# EasyEDA Pro project Teensy PCB.epro

# Schematic Schematic1
Board Name: Board1; Create Date: 2026-01-16; Page Name: P1; Project Name: PCB-5; Schematic Name: Schematic1; Update Date: 2026-02-27; Company: EasyEDA.com; Page Size: A4; Version: V1.0
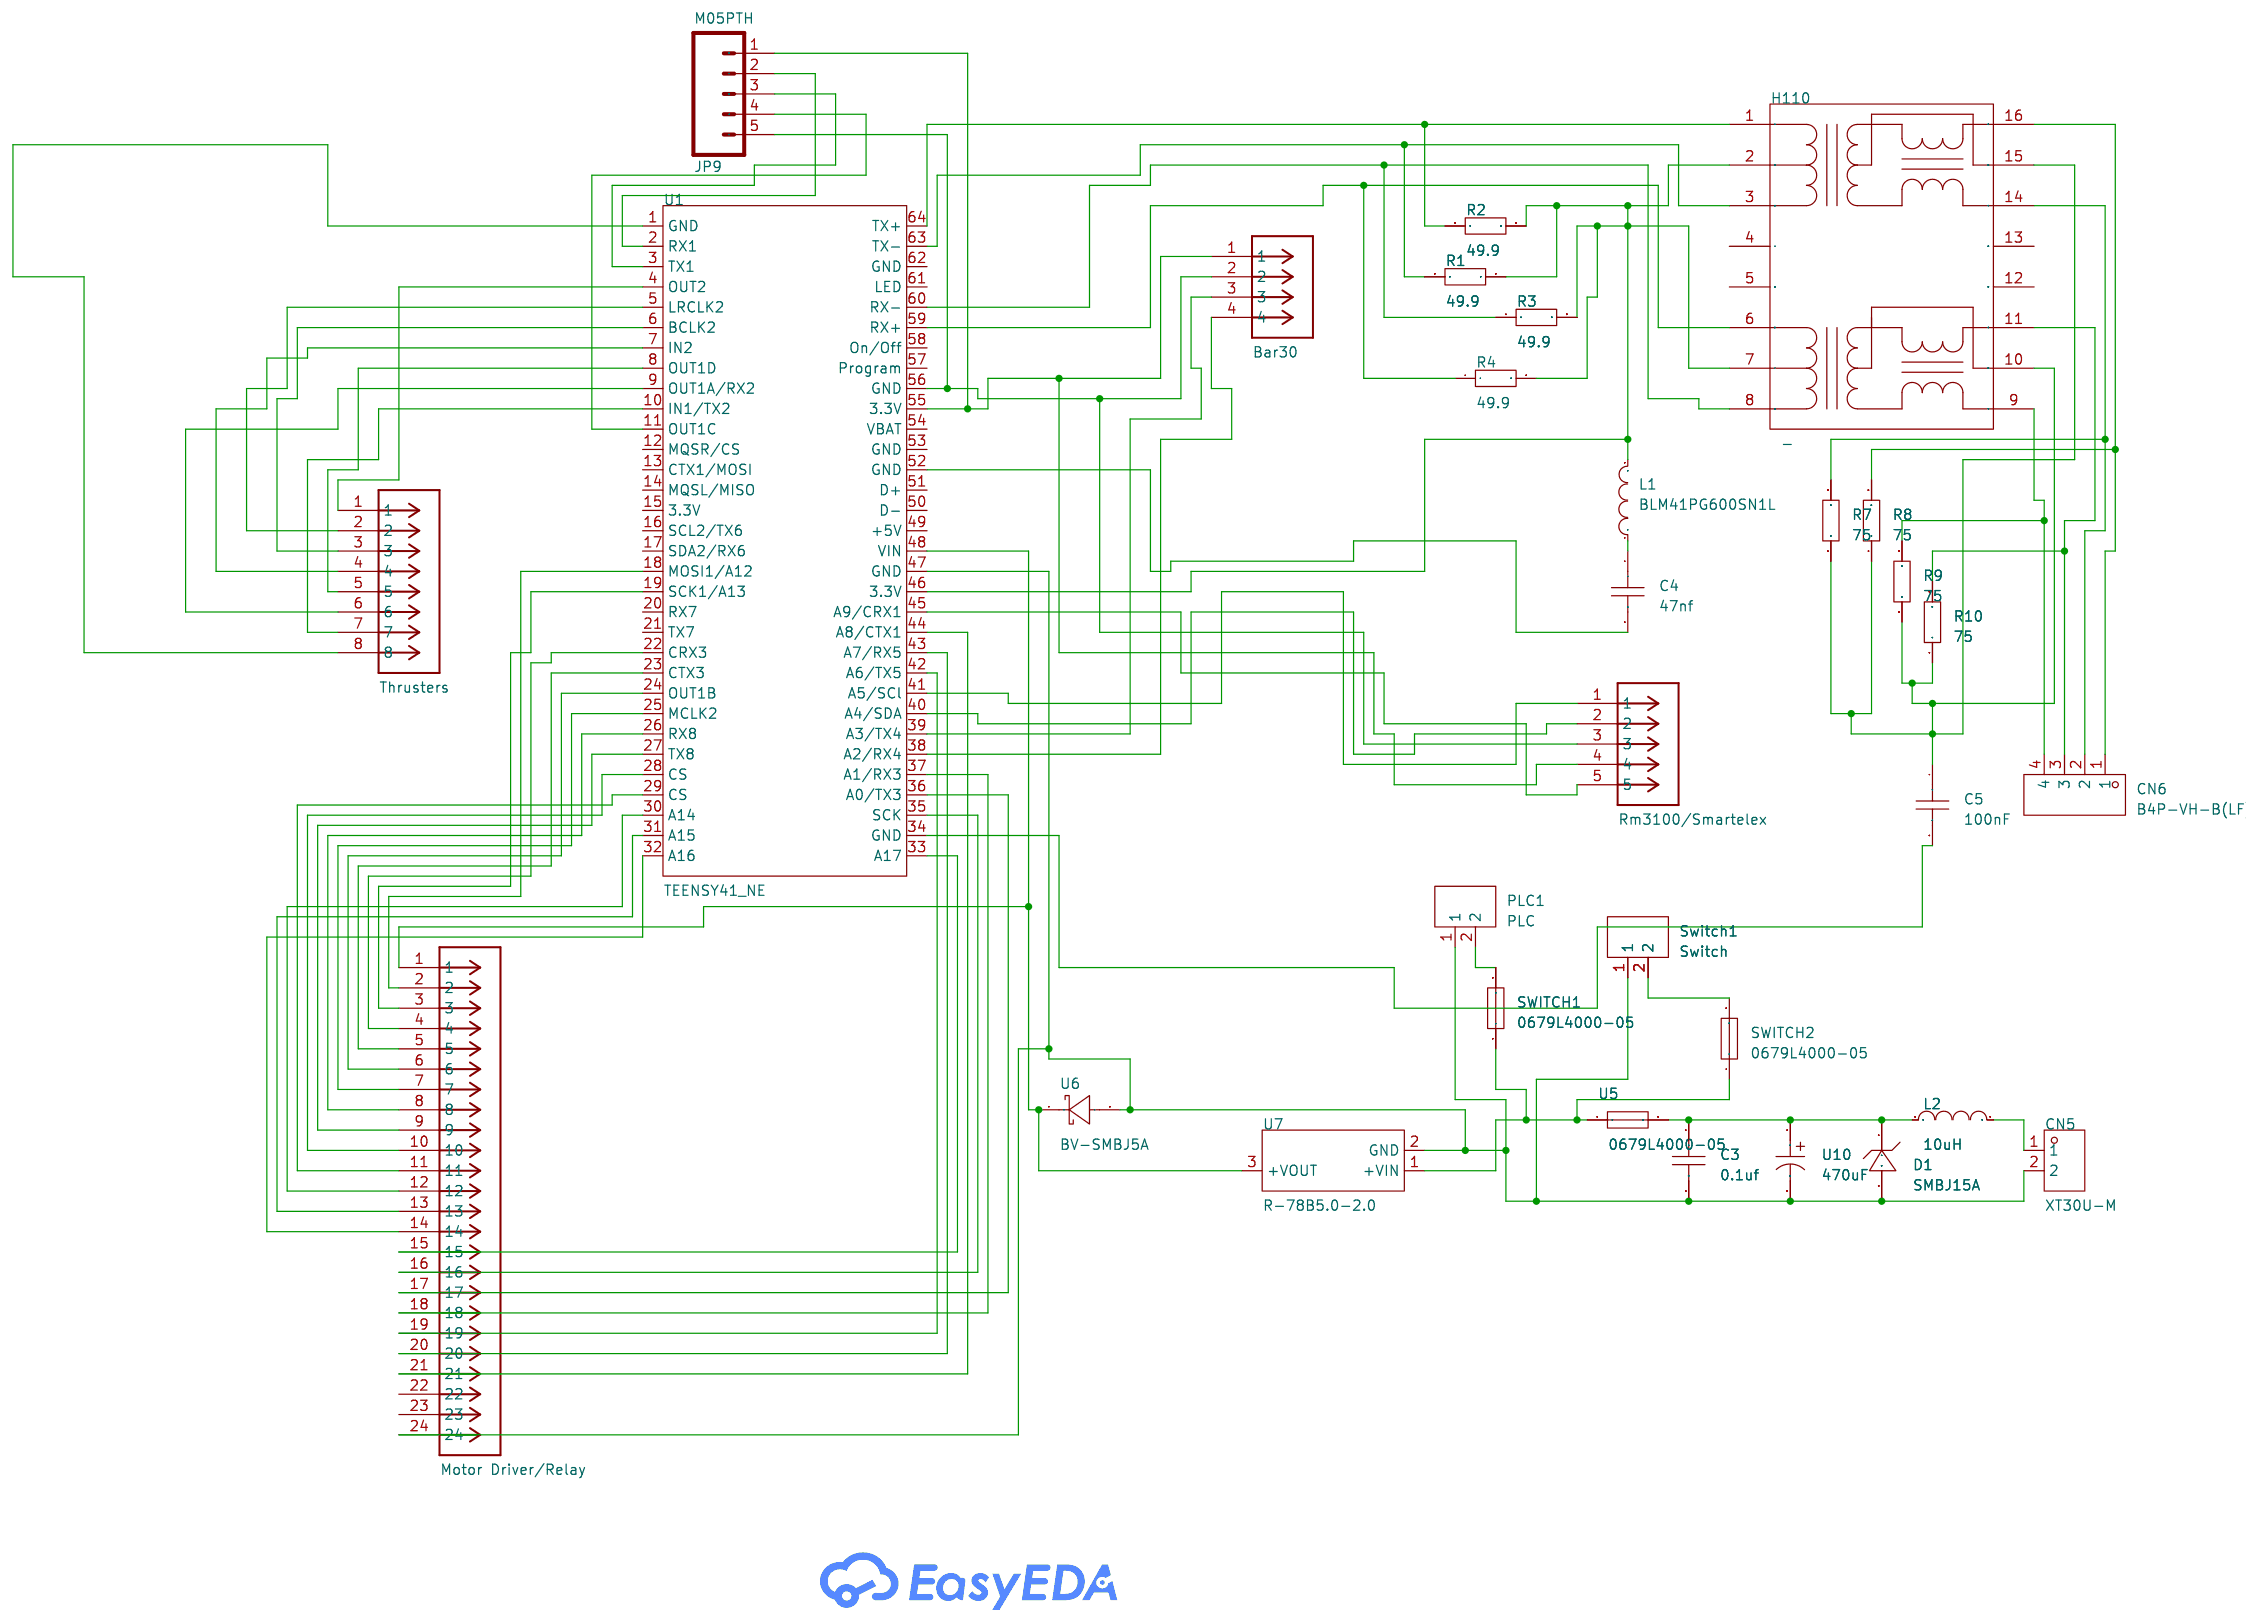
[diagram p0: schematic sheet]

## Parts
Bar30  Bar30  [B4P-VH]
C3  0.1uf  [C0603]
C4  47nf  [C0603]
C5  100nF  [C0603]
CN5  XT30U-M  [CONN-TH_XT30U-M]
CN6  B4P-VH-B(LF)(SN)  [CONN-TH_4P-P3.96_B4P-VH-B-LF-SN]
D1  SMBJ15A  [SMB_L4.6-W3.6-LS5.3-RD]
H110  -  [XFMR-SMD_H1102NLT]
JP9  M05PTH  [1X05]
L1  BLM41PG600SN1L  [L1806]
L2  10uH  [L0603]
MotorDriver/Relay1  Motor Driver/Relay  [15247240]
PLC1  PLC  [CONN-TH_2P-P3.96_DEALON_VH-2A]
R1  49.9  [R0603]
R2  49.9  [R0603]
R3  49.9  [R0603]
R4  49.9  [R0603]
R7  75  [R0603]
R8  75  [R0603]
R9  75  [R0603]
R10  75  [R0603]
SWITCH1  0679L4000-05  [FUSE-SMD_L6.1-W2.5]
Switch1  Switch  [CONN-TH_2P-P3.96_DEALON_VH-2A]
SWITCH2  0679L4000-05  [FUSE-SMD_L6.1-W2.5]
Thrusters1  Thrusters  [444320801]
U1  TEENSY41_NE  [COMM-TH_L60.1-W17.8-P2.54]
U5  0679L4000-05  [FUSE-SMD_L6.1-W2.5]
U6  BV-SMBJ5A  [SMB_L4.6-W3.7-LS5.4-RD]
U7  R-78B5.0-2.0  [PWRM-TH_RECOM_R-78B5.0-2.0]
U10  470uF  [CAP-TH_BD10.0-P5.00-D0.6-FD]
U15  Rm3100/Smartelex  [B5P-VH]

## Library data of the parts
Bar30 = conn_04p_1
C3-C5 = CAP_0603: Supplier Footprint: 0603
CN5 = XT30U-M: LCSC Part Name: AMASS(艾迈斯)轻量版锂电池插头公头 XT30U-M; Supplier Part: C99101; Manufacturer: AMASS(艾迈斯); JLCPCB Part Class: Extended Part; Datasheet: https://item.szlcsc.com/datasheet/XT30U-M/100314.html; Supplier: LCSC
CN6 = B4P-VH-B(LF)(SN): Pins Structure:1x4P Pitch:3.96mm Mounting Style:Direct Insert Reference Series:VH Number of Pins:4P Number of Rows:1 Number of PINs Per Row:4 Row Spacing:- Current Rating (Max):10A Contact Material:Brass Contact Plating:Tin Operating Temperature Range:-25; LCSC Part Name: 1x4P 间距:3.96mm 直插 系列:VH; Supplier Part: C493148; Manufacturer: JST; Supplier Footprint: 插件,P=3.96mm; JLCPCB Part Class: Extended Part; Datasheet: https://atta.szlcsc.com/upload/public/pdf/source/20220208/ECAA58BC68B23E29E576C700CFB0AF43.pdf; Supplier: LCSC; Pins Structure: 1x4P; Pitch: 3.96mm; Mounting Style: Direct Insert; Reference Series: VH; Number of Pins: 4P; Number of Rows: 1; Number of PINs Per Row: 4; Current Rating (Max): 10A; Contact Material: Brass; Contact Plating: Tin; Operating Temperature Range: -25℃~+85℃; Rated Voltage (Max): 250V; Plastic Material: Glass Fiber Reinforced PBT; Flame Retardant Rating: UL94V-0; Colour: White; Z-Height of the Board: 9.4mm; X-Length of Bottom Edge on Board (Spacing Line): 15.78mm; Y-Width of Bottom Edge on Board: 8.5mm
D1 = SMBJ15A_C83846: Polarity:Unidirectional Reverse Stand-Off Voltage (Vrwm):15V Clamping Voltage:24.4V Peak Pulse Current (Ipp):24.6A Peak Pulse Power Dissipation (Ppp):600W Voltage - Breakdown:16.7V Reverse Leakage Current (Ir):1uA Operating Temperature:-65℃~+150℃ Operatin; LCSC Part Name: 单向TVS 15V截止 峰值浪涌电流：24.6A; Supplier Part: C83846; Manufacturer: Littelfuse(美国力特); Supplier Footprint: DO-214AA; JLCPCB Part Class: Extended Part; Datasheet: https://item.szlcsc.com/datasheet/SMBJ15A/85013.html; Supplier: LCSC; Polarity: Unidirectional; Reverse Stand-Off Voltage (Vrwm): 15V; Clamping Voltage: 24.4V; Peak Pulse Current (Ipp): 24.6A; Peak Pulse Power Dissipation (Ppp): 600W; Voltage - Breakdown: 16.7V; Reverse Leakage Current (Ir): 1uA; Operating Temperature: -65℃~+150℃; level of protection: IEC 61000-4-4；IEC 61000-4-2; Type: TVS
H110 = H1102NLT: Turns Ratio:； Number of Channels:- rate:- Function:- Inductance:- Isolation Voltage(Vrms):- operating temperature:0℃~+70℃ operating temperature:0℃~+70℃; Supplier Part: C18584; Manufacturer: PULSE(普思); Supplier Footprint: SMD,12.7x7.1mm; JLCPCB Part Class: Extended Part; Datasheet: https://item.szlcsc.com/datasheet/H1102NLT/19286.html; Supplier: LCSC; Turns Ratio: ；; operating temperature: 0℃~+70℃
JP9 = SparkFun_M05_PTH
L1 = BLM41PG600SN1L: Impedance @ Frequency:60Ω@100MHz Tolerance:±25% Tolerance:±25% DC Resistance(DCR):9mΩ Current Rating:6A Number of Circuits:1; LCSC Part Name: 单路 1806磁珠 阻抗60Ω@100MHz; Supplier Part: C85844; Manufacturer: muRata(村田); Supplier Footprint: 1806; JLCPCB Part Class: Extended Part; Datasheet: https://item.szlcsc.com/datasheet/BLM41PG600SN1L/87020.html; Supplier: LCSC; Impedance @ Frequency: 60Ω@100MHz; Tolerance: ±25%; DC Resistance(DCR): 9mΩ; Current Rating: 6A; Number of Circuits: 1
L2 = L_0603
MotorDriver/Relay1 = conn_024p_000c_1
PLC1 Switch1 = VH-2A: Pins Structure:1x2P Pitch:3.96mm Mounting Type:Through Hole Reference Series:VH Number of Pins:2P Number of Rows:1 Number of PINs Per Row:2 Row Spacing:- Current Rating:7A Contact Material:- Contact Plating:- Operating Temperature:-25℃~+85℃ Operating Temp; LCSC Part Name: 1x2P 间距:3.96mm 直插 系列:VH; Supplier Part: C2905029; Manufacturer: DEALON(德艺隆); Supplier Footprint: 插件,P=3.96mm; JLCPCB Part Class: Extended Part; Datasheet: https://item.szlcsc.com/datasheet/VH-2A/3172314.html; Supplier: LCSC; Pins Structure: 1x2P; Pitch: 3.96mm; Mounting Type: Through Hole; Reference Series: VH; Number of Pins: 2P; Number of Rows: 1; Number of PINs Per Row: 2; Current Rating: 7A; Operating Temperature: -25℃~+85℃; Voltage Rating: 250V; Color: White; Z-Height of the Board: 14.1mm; X-Length of Bottom Edge on Board (Spacing Line): 7.92mm; Y-Width of Bottom Edge on Board: 8.5mm
R1-R4 R7-R10 = Res_0603: Supplier Footprint: 0603
SWITCH1 SWITCH2 U5 = 0679L4000-05: Type:- Current Rating:4A Voltage Rating (AC):125V Voltage Rating (DC):125V Operating Temperature:-55℃~+125℃ Operating Temperature:-55℃~+125℃ Interrupt Rating:50A；300A; LCSC Part Name: 125V; Supplier Part: C3161312; Manufacturer: belfuse; Supplier Footprint: SMD,6.1x2.5mm; JLCPCB Part Class: Extended Part; Datasheet: https://atta.szlcsc.com/upload/public/pdf/source/231023/ds-cp-0679l-series.pdf-3e2d1b65585d6b8342ebf31851bf0027.pdf; Supplier: LCSC; Current Rating: 4A; Voltage Rating (AC): 125V; Voltage Rating (DC): 125V; Operating Temperature: -55℃~+125℃; Interrupt Rating: 50A；300A
Thrusters1 = conn_008p_000c_1
U1 = TEENSY41_NE: Supplier Part: C9900198559; Supplier Footprint: TH-59P; JLCPCB Part Class: Extended Part; Supplier: LCSC
U6 = BV-SMBJ5A: Polarity:Unidirectional Reverse Stand-Off Voltage (Vrwm):5V Clamping Voltage:9.2V Peak Pulse Current (Ipp):65.3A@10/1000us Peak Pulse Power Dissipation (Ppp):600W@10/1000us Voltage - Breakdown:7V Reverse Leakage Current (Ir):800uA Operating Temperature:-5; LCSC Part Name: 单向TVS 5V截止 峰值浪涌电流：65.3A@10/1000us; Supplier Part: C5376239; Manufacturer: Bencent(槟城); Supplier Footprint: SMB; JLCPCB Part Class: Extended Part; Datasheet: https://item.szlcsc.com/datasheet/BV-SMBJ5A/6237095.html; Supplier: LCSC; Polarity: Unidirectional; Reverse Stand-Off Voltage (Vrwm): 5V; Clamping Voltage: 9.2V; Peak Pulse Current (Ipp): 65.3A@10/1000us; Peak Pulse Power Dissipation (Ppp): 600W@10/1000us; Voltage - Breakdown: 7V; Reverse Leakage Current (Ir): 800uA; Operating Temperature: -55℃~+150℃; level of protection: IEC 61000-4-2; Type: TVS
U7 = R-78B5.0-2.0: Number of channel:1 input voltage (Vdc):6.5V~32V input voltage (Vdc):6.5V~32V Conversion Efficiency:94% Conversion Efficiency:94% Output Voltage:5V Output Voltage:5V Output Current (Max):2A Output Current (Max):2A; Supplier Part: C5199920; Manufacturer: Recom Power; Supplier Footprint: SIP-3; JLCPCB Part Class: Extended Part; Datasheet: https://atta.szlcsc.com/upload/public/pdf/source/20221017/14B392F1E511D1F6336598625098CDB1.pdf; Supplier: LCSC; Number of channel: 1; input voltage (Vdc): 6.5V~32V; Conversion Efficiency: 94%; Output Voltage: 5V; Output Current (Max): 2A
U10 = NXA 16V 470UF 10*12.5-5.0TP: Capacitance:470uF Tolerance:±20% Tolerance:±20% Voltage Rating:16V Ripple Current:865mA@100kHz Equivalent Series Resistance(ESR):80mΩ@100kHz Pin Spacing:5mm Diameter:10mm Height - Seated (Max):12.5mm Lifetime:10000hrs@105℃ Operating Temperature:-40℃~+105℃; LCSC Part Name: 470uF ±20% 16V; Supplier Part: C2842806; Manufacturer: SAMYOUNG(韩国三莹); Supplier Footprint: 插件,D10xL12.5mm; JLCPCB Part Class: Extended Part; Datasheet: https://atta.szlcsc.com/upload/public/pdf/source/20210625/C2842806_EDB24EC3CE78173E34F2E9B95A6C6EF7.pdf; Supplier: LCSC; Tolerance: ±20%; Voltage Rating: 16V; Ripple Current: 865mA@100kHz; Equivalent Series Resistance(ESR): 80mΩ@100kHz; Pin Spacing: 5mm; Diameter: 10mm; Height - Seated (Max): 12.5mm; Lifetime: 10000hrs@105℃; Operating Temperature: -40℃~+105℃
U15 = conn_b5p-vh

## Nets
$1N2305: Bar30.4 U1.38(A2/RX4)
$1N15450: Bar30.3 U1.39(A3/TX4)
$1N23846: JP9.2 U1.2(RX1)
$1N23850: JP9.3 U1.3(TX1)
$1N23939: JP9.4 U1.11(OUT1C)
Net-(Bar30-1): Bar30.1 JP9.1 U1.55(3.3V) U15.4
Net-(Bar30-2): Bar30.2 JP9.5 U1.56(GND) U15.3
Net-(C3-1): C3.1 D1.1 L2.1 U5.2 U10.1
Net-(C3-2): C3.2 CN5.2 D1.2 MotorDriver/Relay1.24 PLC1.1 Switch1.1 U1.47(GND) U6.2(A) U7.2(GND) U10.2
Net-(C4-1): C4.1 L1.1
Net-(C4-2): C4.2 U1.52(GND)
Net-(C5-1): C5.1 H110.10 H110.15 R7.1 R8.1 R9.1 R10.1
Net-(C5-2): C5.2 U1.34(GND)
Net-(CN5-1): CN5.1 L2.2
Net-(CN6-1): CN6.1 H110.16 R8.2
Net-(CN6-2): CN6.2 H110.14 R7.2
Net-(CN6-3): CN6.3 H110.11 R10.2
Net-(CN6-4): CN6.4 H110.9 R9.2
Net-(H110-1): H110.1 R2.1 U1.64(TX+)
Net-(H110-2): H110.2 H110.7 L1.2 R1.2 R2.2 R3.2 R4.2 U1.46(3.3V)
Net-(H110-3): H110.3 R1.1 U1.63(TX-)
Net-(H110-6): H110.6 R4.1 U1.59(RX+)
Net-(H110-8): H110.8 R3.1 U1.60(RX-)
Net-(MotorDriver/Relay1-1): MotorDriver/Relay1.1 U1.48(VIN) U6.1(K) U7.3(+VOUT)
Net-(MotorDriver/Relay1-2): MotorDriver/Relay1.2 U1.18(MOSI1/A12)
Net-(MotorDriver/Relay1-3): MotorDriver/Relay1.3 U1.19(SCK1/A13)
Net-(MotorDriver/Relay1-4): MotorDriver/Relay1.4 U1.22(CRX3)
Net-(MotorDriver/Relay1-5): MotorDriver/Relay1.5 U1.23(CTX3)
Net-(MotorDriver/Relay1-6): MotorDriver/Relay1.6 U1.24(OUT1B)
Net-(MotorDriver/Relay1-7): MotorDriver/Relay1.7 U1.25(MCLK2)
Net-(MotorDriver/Relay1-8): MotorDriver/Relay1.8 U1.26(RX8)
Net-(MotorDriver/Relay1-9): MotorDriver/Relay1.9 U1.27(TX8)
Net-(MotorDriver/Relay1-10): MotorDriver/Relay1.10 U1.28(CS)
Net-(MotorDriver/Relay1-11): MotorDriver/Relay1.11 U1.29(CS)
Net-(MotorDriver/Relay1-12): MotorDriver/Relay1.12 U1.30(A14)
Net-(MotorDriver/Relay1-13): MotorDriver/Relay1.13 U1.31(A15)
Net-(MotorDriver/Relay1-14): MotorDriver/Relay1.14 U1.32(A16)
Net-(MotorDriver/Relay1-15): MotorDriver/Relay1.15 U1.33(A17)
Net-(MotorDriver/Relay1-16): MotorDriver/Relay1.16 U1.35(SCK)
Net-(MotorDriver/Relay1-17): MotorDriver/Relay1.17 U1.36(A0/TX3)
Net-(MotorDriver/Relay1-18): MotorDriver/Relay1.18 U1.37(A1/RX3)
Net-(MotorDriver/Relay1-19): MotorDriver/Relay1.19 U1.42(A6/TX5)
Net-(MotorDriver/Relay1-20): MotorDriver/Relay1.20 U1.43(A7/RX5)
Net-(MotorDriver/Relay1-21): MotorDriver/Relay1.21 U1.44(A8/CTX1)
Net-(PLC1-2): PLC1.2 SWITCH1.2
Net-(SWITCH1-1): SWITCH1.1 SWITCH2.1 U5.1 U7.1(+VIN)
Net-(Switch1-2): Switch1.2 SWITCH2.2
Net-(Thrusters1-1): Thrusters1.1 U1.4(OUT2)
Net-(Thrusters1-2): Thrusters1.2 U1.5(LRCLK2)
Net-(Thrusters1-3): Thrusters1.3 U1.6(BCLK2)
Net-(Thrusters1-4): Thrusters1.4 U1.7(IN2)
Net-(Thrusters1-5): Thrusters1.5 U1.8(OUT1D)
Net-(Thrusters1-6): Thrusters1.6 U1.9(OUT1A/RX2)
Net-(Thrusters1-7): Thrusters1.7 U1.10(IN1/TX2)
Net-(Thrusters1-8): Thrusters1.8 U1.1(GND)
Net-(U1-40): U1.40(A4/SDA) U15.2
Net-(U1-41): U1.41(A5/SCl) U15.1
Net-(U1-45): U1.45(A9/CRX1) U15.5

Not connected (* = marked no-connect by the designer): H110 4 5 12 13; MotorDriver/Relay1 22 23; U1 12(MQSR/CS) 13(CTX1/MOSI) 14(MQSL/MISO) 15(3.3V) 16(SCL2/TX6) 17(SDA2/RX6) 20(RX7) 21(TX7) 49(+5V) 50(D-) 51(D+) 53(GND) 54(VBAT) 57(Program) 58(On/Off) 61(LED) 62(GND)

# Board PCB7
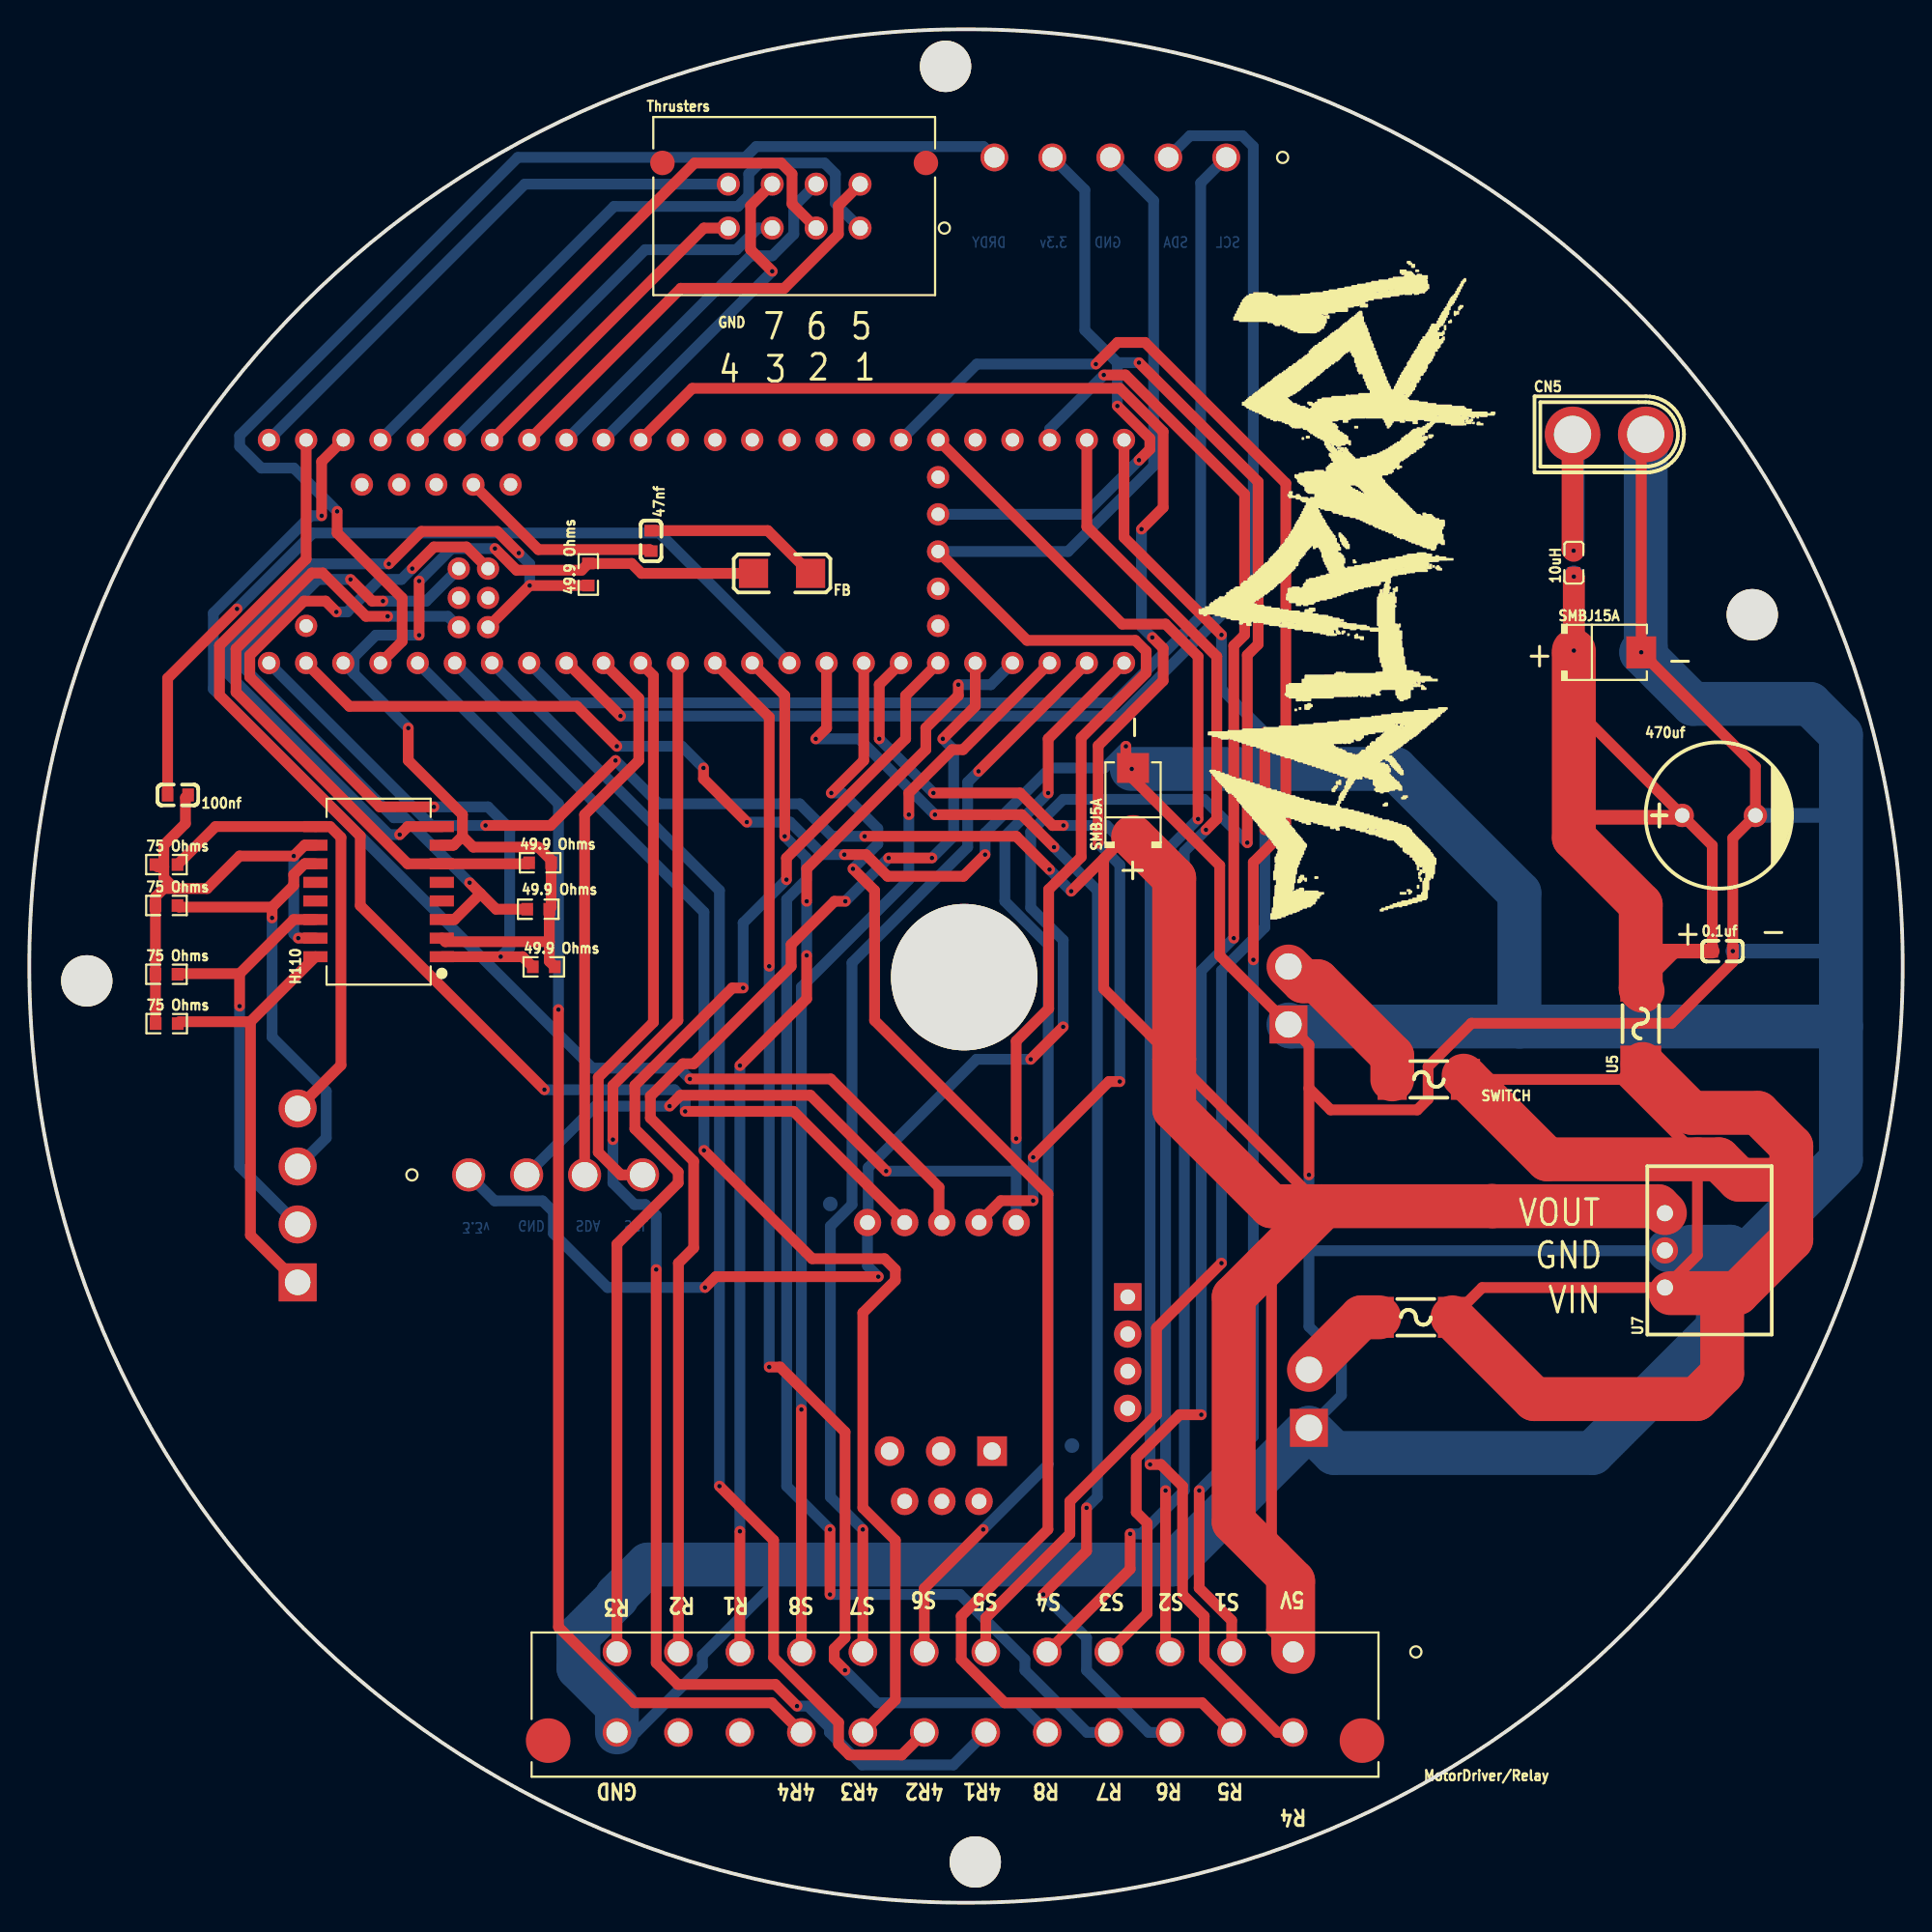
[diagram p1: board, top side]
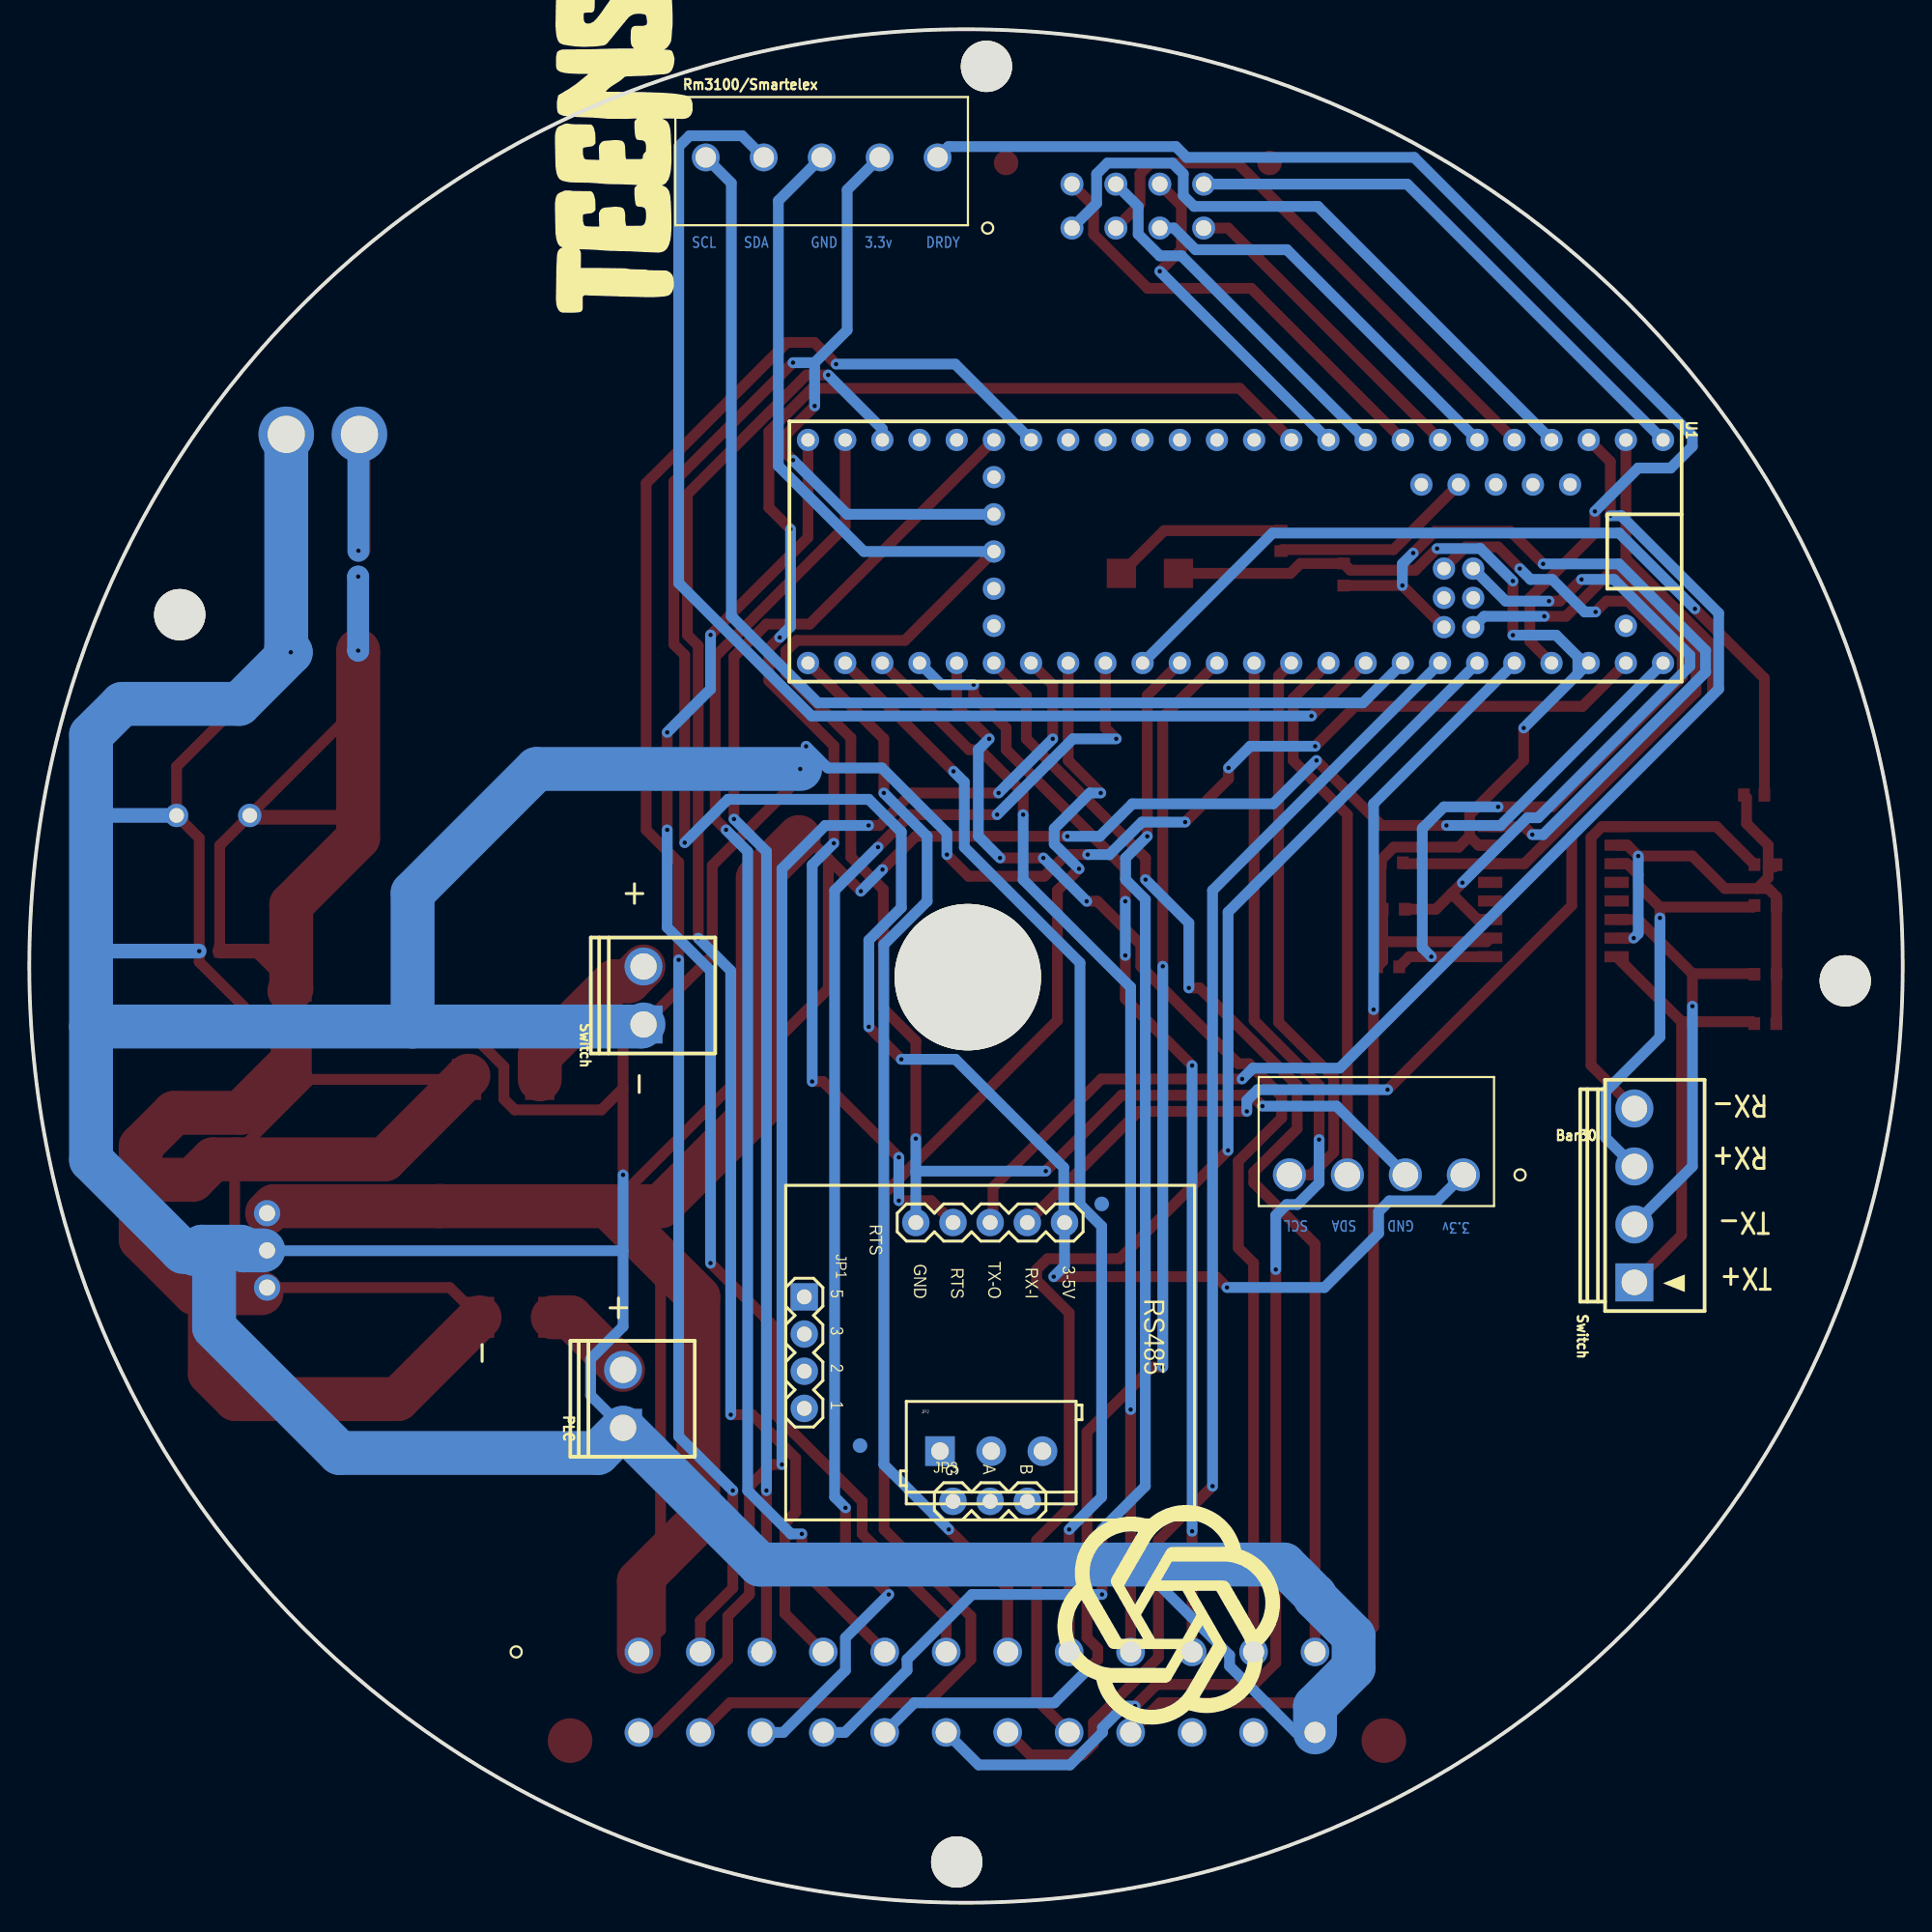
[diagram p2: board, bottom side, seen from below]

Outline 128 x 128 mm; copper layers: Top Layer, Bottom Layer. Coordinates in mm from the lower left corner of the outline.
Outline path: circle c64,64 r64
Stack: Top Layer 0.035mm / Dielectric1 1.51mm FR4 er 4.5 / Bottom Layer 0.035mm

## Design rules (mm)
template: Custom Config
spacing copperThickness1oz (default): track to track 0.102, other pairs 0.152 to 0.3
spacing copperThickness2oz: track to track 0.203, other pairs 0.152 to 0.3
track width copperThickness1oz (default): min 0.127, default 0.254, max 3
track width copperThickness2oz: min 0.203, default 0.254, max 2.54
differential pair differentialPair (default): width min 0.127, default 0.254, max 2.54; gap min 0.152, default 0.152
via viaSize (default): diameter min 0.5, default 0.61, max 10; hole min 0.3, default 0.305, max 6.3

## Placement (name value [footprint] x y rotation side)
0.1uf  0.1uf  [C0603]  115.69 65.02 0 top
10uH  10uH  [L0603]  105.53 91.56 90 top
47nf  47nf  [C0603]  42.48 93.05 270 top
49.9 Ohms  -  [R0603]  34.77 67.88 0 top
49.9 Ohms#2  -  [R0603]  34.9 71.05 0 top
49.9 Ohms#3  -  [R0603]  35.16 63.94 0 top
49.9 Ohms#4  -  [R0603]  38.19 90.75 90 top
75 Ohms  -  [R0603]  9.37 68.13 0 top
75 Ohms#2  -  [R0603]  9.37 70.93 0 top
75 Ohms#3  -  [R0603]  9.37 63.43 0 top
75 Ohms#4  -  [R0603]  9.39 60.06 0 top
100nf  100nF  [C0603]  10.15 75.68 180 top
470uf  470uF  [CAP-TH_BD10.0-P5.00-D0.6-FD]  115.44 74.29 0 top
Bar30  Bar30  [B4P-VH]  30.02 49.73 0 bottom
CN5  XT30U-M  [CONN-TH_XT30U-M]  107.94 100.32 0 top
FB  BLM41PG600SN1L  [L1806]  51.43 90.83 180 top
H110  -  [XFMR-SMD_H1102NLT]  23.87 69.08 90 top
JP1  SparkFun_M04_PTH  [1X04]  75.05 41.39 270 bottom
JP2  SparkFun_M03_SCREW  [SCREWTERMINAL-3.5MM-3]  65.78 30.85 180 bottom
JP3  SparkFun_M03_PTH  [1X03]  64.89 27.42 180 bottom
JP5  FIDUCIAL1X2  [FIDUCIAL-1X2]  71.24 31.23 270 bottom
JP6  -  [STAND-OFF]  73.78 46.47 270 bottom
JP7  -  [STAND-OFF]  50.92 28.69 270 bottom
JP8  -  [STAND-OFF]  73.78 28.69 270 bottom
JP9  M05PTH  [1X05]  57.27 46.47 0 bottom
JP10  FIDUCIAL1X2  [FIDUCIAL-1X2]  54.73 47.74 270 bottom
JP15  -  [STAND-OFF]  50.92 46.47 270 bottom
MotorDriver/Relay  Motor Driver/Relay  [15247240]  86.35 17.14 180 top
NOREF  -  [Pad_e3]  64.64 2.79 0 top
NOREF#2  -  [Pad_e1006]  63.88 63.24 0 top
NOREF#3  -  [Pad_e4]  3.93 62.98 0 top
NOREF#4  -  [Pad_e0]  62.6 125.47 0 top
NOREF#5  -  [Pad_e6]  117.72 88 0 top
PLC  -  [FUSE-SMD_L6.1-W2.5]  94.73 40 180 top
PLC#2  -  [CONN-TH_2P-P3.96_DEALON_VH-2A]  87.43 34.43 90 bottom
Rm3100/Smartelex  Rm3100/Smartelex  [B5P-VH]  81.78 119.25 180 bottom
SMBJ5A  BV-SMBJ5A  [SMB_L4.6-W3.7-LS5.4-RD]  75.41 75.17 90 top
SMBJ15A  SMBJ15A  [SMB_L4.6-W3.6-LS5.3-RD]  107.77 85.43 0 top
SWITCH  0679L4000-05  [FUSE-SMD_L6.1-W2.5]  95.62 56.25 180 top
Switch  Switch  [CONN-TH_2P-P3.96_DEALON_VH-2A]  86.03 61.99 90 bottom
Switch   -  [CONN-TH_4P-P3.96_B4P-VH-B-LF-SN]  18.34 48.32 90 bottom
Thrusters  Thrusters  [444320801]  56.76 114.42 0 top
U1  TEENSY41_NE  [COMM-TH_L60.1-W17.8-P2.54]  45.59 92.32 270 bottom
U5  0679L4000-05  [FUSE-SMD_L6.1-W2.5]  110.1 60.06 90 top
U7  R-78B5.0-2.0  [PWRM-TH_RECOM_R-78B5.0-2.0]  111.75 44.57 90 top

## Footprints (pads in the part's own frame, mm; a bottom-side part is the same pattern mirrored in y, then rotated)
1X03
  round 1.879 hole 1.016: 1(0,0) 2(2.54,0) 3(5.08,0)
1X04
  rect 1.879x1.879 hole 1.016: 1(0,0)
  round 1.879 hole 1.016: 2(2.54,0) 3(5.08,0) 4(7.62,0)
1X05
  round 1.879 hole 1.016: 1(0,0) 2(2.54,0) 3(5.08,0) 4(7.62,0) 5(10.16,0)
15247240
  round 1.956 hole 1.448: 1(0,0) 2(4.2,0) 3(8.4,0) 4(12.6,0) 5(16.8,0) 6(21,0) 7(25.2,0) 8(29.4,0) 9(33.6,0) 10(37.8,0) 11(42,0) 12(46.2,0) 13(0,5.5) 14(4.2,5.5) 15(8.4,5.5) 16(12.6,5.5) 17(16.8,5.5) 18(21,5.5) 19(25.2,5.5) 20(29.4,5.5) 21(33.6,5.5) 22(37.8,5.5) 23(42,5.5) 24(46.2,5.5)
  round 3.048 smd: 25(-4.7,6.06) 26(50.9,6.06)
444320801
  round 1.575 hole 1.067: 1(0,0) 2(-3,0) 3(-6,0) 4(-9,0) 5(0,3) 6(-3,3) 7(-6,3) 8(-9,3)
  round 1.677 smd: 9(-13.5,4.45) 10(4.5,4.45)
B4P-VH
  round 2.26 hole 1.752: 1(0,0) 2(3.96,0) 3(7.92,0) 4(11.88,0)
B5P-VH
  round 1.905 hole 1.397: 1(0,0) 2(3.96,0) 3(7.92,0) 4(11.88,0) 5(15.84,0)
C0603
  rect 0.8x0.9 smd: 1(-0.7,0) 2(0.7,0)
CAP-TH_BD10.0-P5.00-D0.6-FD
  round 1.6 hole 1: 1(-2.5,0) 2(2.5,0)
COMM-TH_L60.1-W17.8-P2.54
  round 1.524 hole 0.914: 1(-7.62,29.21) 2(-7.62,26.67) 3(-7.62,24.13) 4(-7.62,21.59) 5(-7.62,19.05) 6(-7.62,16.51) 7(-7.62,13.97) 8(-7.62,11.43) 9(-7.62,8.89) 10(-7.62,6.35) 11(-7.62,3.81) 12(-7.62,1.27) 13(-7.62,-1.27) 14(-7.62,-3.81) 15(-7.62,-6.35) 16(-7.62,-8.89) 17(-7.62,-11.43) 18(-7.62,-13.97) 19(-7.62,-16.51) 20(-7.62,-19.05) 21(-7.62,-21.59) 22(-7.62,-24.13) 23(-7.62,-26.67) 24(-7.62,-29.21) 25(7.62,-29.21) 26(7.62,-26.67) 27(7.62,-24.13) 28(7.62,-21.59) 29(7.62,-19.05) 30(7.62,-16.51) 31(7.62,-13.97) 32(7.62,-11.43) 33(7.62,-8.89) 34(7.62,-6.35) 35(7.62,-3.81) 36(7.62,-1.27) 37(7.62,1.27) 38(7.62,3.81) 39(7.62,6.35) 40(7.62,8.89) 41(7.62,11.43) 42(7.62,13.97) 43(7.62,16.51) 44(7.62,19.05) 45(7.62,21.59) 46(7.62,24.13) 47(7.62,26.67) 48(7.62,29.21) 49(-4.57,22.86) 50(-4.57,20.32) 51(-4.57,17.78) 52(-4.57,15.24) 53(-4.57,12.7) 54(-5.08,-16.51) 55(-2.54,-16.51) 56(0,-16.51) 57(2.54,-16.51) 58(5.08,-16.51) 59(5.17,16.24) 60(5.17,14.24) 61(3.17,16.24) 62(3.17,14.24) 63(1.17,16.24) 64(1.17,14.24) 65(5.08,26.67)
CONN-TH_2P-P3.96_DEALON_VH-2A
  rect 2.6x2.6 hole 1.8: 1(-1.98,0)
  round 2.6 hole 1.8: 2(1.98,0)
CONN-TH_4P-P3.96_B4P-VH-B-LF-SN
  rect 2.6x2.6 hole 1.75: 1(-5.94,0)
  round 2.6 hole 1.75: 2(-1.98,0) 3(1.98,0) 4(5.94,0)
CONN-TH_XT30U-M
  round 3.8 hole 2.54: 1(-2.5,0) 2(2.5,0)
FIDUCIAL-1X2
  round 1 smd: 1(0,0)
FUSE-SMD_L6.1-W2.5
  rect 2x2.8 smd: 1(-2.5,0) 2(2.5,0)
L0603
  rect 0.8x0.864 smd: 1(-0.7,0) 2(0.7,0)
L1806
  rect 2x2 smd: 1(-1.95,0) 2(1.95,0)
Pad_e0
  round 3.5 hole 3.5: 1(0,0)
Pad_e3
  round 3.5 hole 3.5: 1(0,0)
Pad_e4
  round 3.5 hole 3.5: 1(0,0)
Pad_e6
  round 3.5 hole 3.5: 1(0,0)
Pad_e1006
  round 10 hole 10: 1(0,0)
PWRM-TH_RECOM_R-78B5.0-2.0
  round 1.8 hole 1.1: 1(-2.54,0) 2(0,0) 3(2.54,0)
R0603
  rect 0.806x0.864 smd: 1(-0.753,0) 2(0.753,0)
SCREWTERMINAL-3.5MM-3
  rect 2.032x2.032 hole 1.2: 1(0,0)
  round 2.032 hole 1.2: 2(3.5,0) 3(7,0)
SMB_L4.6-W3.6-LS5.3-RD
  rect 2.047x2.192 smd: 1(-2.361,0) 2(2.361,0)
SMB_L4.6-W3.7-LS5.4-RD
  rect 2.047x2.192 smd: 1(-2.361,0) 2(2.361,0)
XFMR-SMD_H1102NLT
  rect 0.76x1.66 smd: 1(-4.445,-4.318) 2(-3.175,-4.318) 3(-1.905,-4.318) 4(-0.635,-4.318) 5(0.635,-4.318) 6(1.905,-4.318) 7(3.175,-4.318) 8(4.445,-4.318) 9(4.445,4.318) 10(3.175,4.318) 11(1.905,4.318) 12(0.635,4.318) 13(-0.635,4.318) 14(-1.905,4.318) 15(-3.175,4.318) 16(-4.445,4.318)

## Nets
GND: JP3.1
A: JP3.2
B: JP3.3
$1N773: Rm3100/Smartelex.2 U1.40
$1N1051: 49.9 Ohms#3.1 H110.1 U1.64
$1N1056: 49.9 Ohms.1 H110.3 U1.63
$1N1576: 49.9 Ohms#2.1 H110.6 U1.59
$1N1589: 49.9 Ohms#4.1 H110.8 U1.60
$1N1641: Thrusters.6 U1.9
$1N2305: Bar30.4 U1.38
$1N4072: Rm3100/Smartelex.5 U1.45
$1N4439: 49.9 Ohms.2 49.9 Ohms#2.2 49.9 Ohms#3.2 49.9 Ohms#4.2 FB.2 H110.2 H110.7 U1.46
$1N4525: 47nf.1 FB.1
$1N4816: Thrusters.4 U1.7
$1N4824: Thrusters.3 U1.6
$1N4860: Thrusters.5 U1.8
$1N5635: 75 Ohms#4.2 H110.16 Switch .1
$1N5642: 75 Ohms#3.2 H110.14 Switch .2
$1N5650: 75 Ohms.2 H110.11 Switch .3
$1N5675: 75 Ohms#2.2 H110.9 Switch .4
$1N6260: 75 Ohms.1 75 Ohms#2.1 75 Ohms#3.1 75 Ohms#4.1 100nf.1 H110.10 H110.15
$1N6390: 100nf.2 U1.34
$1N7113: 10uH.2 CN5.1
$1N7117: 0.1uf.1 10uH.1 470uf.1 SMBJ15A.1 U5.2
$1N7480: MotorDriver/Relay.1 SMBJ5A.1 U1.48 U7.3
$1N9545: MotorDriver/Relay.8 U1.26
$1N9555: MotorDriver/Relay.6 U1.24
$1N9567: MotorDriver/Relay.3 U1.19
$1N9589: MotorDriver/Relay.5 U1.23
$1N9599: MotorDriver/Relay.7 U1.25
$1N9611: MotorDriver/Relay.9 U1.27
$1N9625: MotorDriver/Relay.11 U1.29
$1N9639: MotorDriver/Relay.10 U1.28
$1N9649: MotorDriver/Relay.12 U1.30
$1N9665: MotorDriver/Relay.14 U1.32
$1N9673: MotorDriver/Relay.15 U1.33
$1N9678: MotorDriver/Relay.16 U1.35
$1N9686: MotorDriver/Relay.17 U1.36
$1N12928: MotorDriver/Relay.2 U1.18
$1N13407: MotorDriver/Relay.4 U1.22
$1N13585: MotorDriver/Relay.13 U1.31
$1N13636: MotorDriver/Relay.18 U1.37
$1N13655: MotorDriver/Relay.19 U1.42
$1N13664: MotorDriver/Relay.20 U1.43
$1N13701: MotorDriver/Relay.21 U1.44
$1N14167: 0.1uf.2 470uf.2 CN5.2 MotorDriver/Relay.24 PLC#2.1 SMBJ5A.2 SMBJ15A.2 Switch.1 U1.47 U7.2
$1N14276: SWITCH.2 Switch.2
$1N15124: Bar30.2 JP9.5 Rm3100/Smartelex.3 U1.56
$1N15145: Bar30.1 JP9.1 Rm3100/Smartelex.4 U1.55
$1N15159: Rm3100/Smartelex.1 U1.41
$1N15450: Bar30.3 U1.39
$1N16739: Thrusters.8 U1.1
$1N19793: Thrusters.7 U1.10
$1N19945: Thrusters.1 U1.4
$1N19970: Thrusters.2 U1.5
$1N23846: JP9.2 U1.2
$1N23850: JP9.3 U1.3
$1N23939: JP9.4 U1.11
$1N25899: PLC.2 PLC#2.2
$1N25912: PLC.1 SWITCH.1 U5.1 U7.1
$1N26259: 47nf.2 U1.52

Pads without a net: H110 4 5 12 13; JP1 1 2 3 4; JP2 1 2 3; JP5 1; JP10 1; MotorDriver/Relay 22 23 25 26; NOREF 1; NOREF#2 1; NOREF#3 1; NOREF#4 1; NOREF#5 1; Thrusters 9 10; U1 12 13 14 15 16 17 20 21 49 50 51 53 54 57 58 61 62 65

## Via types
v1: diameter 0.61, hole 0.305, Top Layer to Bottom Layer, 112 vias
v2: diameter 0.7, hole 0.305, Top Layer to Bottom Layer, 5 vias

## Routing (per net, layer and track width the routed paths; a pad name or vN(x,y) marks a point on that pad's centre or on a via; arc(x,y) is an arc through that point)
$1N773: length 88.7
  Top Layer w0.74: v1(40.4,81.08) 36.77,84.7 U1.40
  Bottom Layer w0.74: v1(40.4,81.08) 74.55,81.08 83.63,90.17 83.63,119.99 82.89,120.73 79.3,120.73 Rm3100/Smartelex.2
$1N1051: length 59.6
  Top Layer w0.74: v1(26.17,91.15) 27.65,92.63 29.87,92.63 U1.64 ; v1(27.65,74.87) 23.95,74.87 15.07,83.75 15.07,85.23 18.77,88.93 20.25,88.93 v1(20.99,88.19) ; 49.9 Ohms#3.1 33.71,64.64 v1(32.21,64.64) H110.1
  Bottom Layer w0.74: v1(32.21,64.64) 32.83,65.25 32.83,73.39 31.35,74.87 v1(27.65,74.87) ; v1(20.99,88.19) 21.73,88.19 23.95,90.41 25.43,90.41 v1(26.17,91.15)
$1N1056: length 48.9
  Top Layer w0.74: v1(21.95,90.41) 23.43,88.93 v1(24.17,88.93) ; 30.83,68.95 29.05,67.18 H110.3 ; 30.83,68.95 31.9,67.88 49.9 Ohms.1 ; 30.83,68.95 v1(30.09,69.69)
  Bottom Layer w0.74: v1(30.09,69.69) 25.65,74.13 24.91,74.13 14.55,84.49 14.55,85.23 19.73,90.41 v1(21.95,90.41) ; v1(24.17,88.93) 27.13,88.93 U1.63
$1N1576: length 46.8
  Top Layer w0.74: 49.9 Ohms#2.1 34.08,70.99 H110.6 25.85,70.99 14.13,82.71 14.13,85.67 19.31,90.85 20.05,90.85 23.01,87.89 v1(24.49,87.89)
  Bottom Layer w0.74: U1.59 28.61,87.89 v1(24.49,87.89)
$1N1589: length 55.5
  Top Layer w0.74: H110.8 25.86,73.53 v1(25.31,72.97) ; U1.60 v1(34.19,89.99) 49.9 Ohms#4.1 ; v1(33.45,92.21) 31.97,93.69 26.79,93.69 v1(24.57,91.47)
  Bottom Layer w0.74: v1(34.19,89.99) 34.19,91.47 v1(33.45,92.21) ; v1(24.57,91.47) 19.39,91.47 13.47,85.55 13.47,84.07 24.57,72.97 v1(25.31,72.97)
$1N1641: length 25.4
  Bottom Layer w0.74: U1.9 49.28,112.52 50.75,112.52 52.24,114 52.24,115.89 Thrusters.6
$1N2305: length 39
  Top Layer w0.74: U1.38 42.64,83.83 42.64,60.15 38.88,56.39 38.88,51.27 40.42,49.73 Bar30.4
$1N4072: length 82.1
  Top Layer w0.74: U1.45 25.48,86.18 25.48,89.14 21.04,93.58 v1(21.04,95.06)
  Bottom Layer w0.74: v1(21.04,95.06) 18.08,98.02 15.86,98.02 14.38,99.5 14.38,100.24 33.38,119.25 48.92,119.25 49.66,119.99 65.2,119.99 Rm3100/Smartelex.5
$1N4439: length 73.3
  Top Layer w0.74: 35.53,65.66 28.43,65.66 H110.2 ; 35.53,65.66 49.9 Ohms.2 35.65,68.01 35.65,71.24 34.78,72.12 30.34,72.12 29.6,72.86 ; 35.53,65.66 35.53,64.32 35.91,63.94 ; v1(25.9,80.26) 25.9,78.04 29.6,74.34 29.6,72.86 ; v1(26.64,86.6) v1(26.64,90.3) ; 29.6,72.86 28.99,72.26 H110.7 ; v1(31.82,92.52) 33.3,91.04 37.74,91.04 49.9 Ohms#4.2 41.15,91.5 41.83,90.83 FB.2
  Bottom Layer w0.74: v1(31.82,92.52) 28.86,92.52 v1(26.64,90.3) ; 22.2,83.96 22.2,85.12 23.68,86.6 v1(26.64,86.6) ; 22.2,83.96 v1(25.9,80.26) ; 22.2,83.96 U1.46
$1N4525: length 12.1
  Top Layer w0.74: FB.1 50.46,93.75 47nf.1
$1N4816: length 22.1
  Top Layer w0.74: U1.7 46.09,114.42 Thrusters.4
$1N4824: length 27.7
  Bottom Layer w0.74: Thrusters.3 49.8,114.42 48.31,112.94 42.07,112.94 U1.6
$1N4860: length 31
  Top Layer w0.74: U1.8 44.52,110.3 51.58,110.3 55.28,114 55.28,115.94 Thrusters.5
$1N5635: length 30.4
  Top Layer w0.74: H110.16 15.11,60.2 ; 15.11,60.2 15.11,45.61 Switch .1 ; 15.11,60.2 10.28,60.2 75 Ohms#4.2
$1N5642: length 29.7
  Top Layer w0.74: 14.37,63.48 v1(14.37,61.26) ; 14.37,63.48 18.07,67.18 H110.14 ; 14.37,63.48 10.17,63.48 75 Ohms#3.2
  Bottom Layer w0.74: Switch .2 14.37,50.31 v1(14.37,61.26)
$1N5650: length 31.2
  Top Layer w0.74: 16.59,68.03 10.24,68.03 75 Ohms.2 ; 16.59,68.03 18.07,69.51 18.07,70.25 18.81,70.99 H110.11 ; 16.59,68.03 v1(16.59,67.29)
  Bottom Layer w0.74: Switch .3 20.29,52.26 20.29,55.45 16.59,59.15 v1(16.59,67.29)
$1N5675: length 32.3
  Top Layer w0.74: 75 Ohms#2.2 12.73,73.53 H110.9 20.56,73.53 21.3,72.79 21.3,57.22 Switch .4
$1N6260: length 36
  Top Layer w0.74: 9.93,69.3 12.15,69.3 14.37,71.52 v1(18.07,71.52) 18.81,72.26 H110.10 ; 9.93,69.3 9.19,69.3 8.62,68.73 75 Ohms.1 75 Ohms#3.1 8.62,60.08 75 Ohms#4.1 ; 9.93,69.3 9.19,70.04 9.19,70.78 ; 9.19,70.78 9.19,72.26 10.67,73.74 10.67,75.5 100nf.1 ; 9.19,70.78 8.77,70.78 75 Ohms#2.1 ; v1(18.38,65.91) H110.15
  Bottom Layer w0.74: v1(18.07,71.52) 18.07,66.22 v1(18.38,65.91)
$1N6390: length 58.2
  Top Layer w0.74: 100nf.2 9.45,83.66 v1(14.2,88.4)
  Bottom Layer w0.74: v1(14.2,88.4) 19.38,93.58 43.06,93.58 U1.34
$1N7113: length 17
  Top Layer w0.74: 105.53,100.24 CN5.1
  Top Layer w1.5: CN5.1 105.44,92.44 v2(105.51,92.37)
  Bottom Layer w1.5: 105.54,101.23 105.51,101.21 v2(105.51,92.37)
$1N7117: length 71.5
  Top Layer w0.74: SMBJ15A.1 105.46,85.39 105.53,85.39 ; 105.53,81.69 470uf.1 114.99,72.23 0.1uf.1 ; 112.55,65.02 U5.2
  Top Layer w1: 105.78,74.16 112.81,74.16 470uf.1 ; 110.36,64.89 110.48,65.02 0.1uf.1
  Top Layer w1.5: 105.53,90.54 v2(105.53,85.55) SMBJ15A.1
  Top Layer w3: v2(105.53,85.55) 105.53,72.76 110.1,68.19 U5.2 110.1,62.44 110.23,62.31
  Bottom Layer w1.5: v2(105.53,85.55) 105.53,85.55 105.53,90.6 v2(105.53,90.61)
$1N7480: length 241.3
  Top Layer w0.74: 73.41,71.33 73.41,62.45 88.75,47.11 U7.3 ; 73.41,71.33 v1(71.19,69.11) ; 73.41,71.33 74.89,72.81 SMBJ5A.1 ; v1(69.71,70.59) 67.44,72.86 v1(57.08,72.86) ; MotorDriver/Relay.1 84.87,18.62 84.87,43.23 ; v1(40.06,78.04) 35.62,73.6 v1(31.18,73.6)
  Top Layer w3: 99.94,47.62 99.97,47.59 ; 99.97,47.59 111.28,47.59 111.75,47.12 ; 99.97,47.59 84.86,47.59 78.22,54.22 78.22,70 SMBJ5A.1 ; MotorDriver/Relay.1 86.35,21.96 82.29,26.03 82.29,41.39 88,47.11
  Bottom Layer w0.74: v1(40.06,78.04) 43.02,75.08 52.64,75.08 54.86,72.86 v1(57.08,72.86) ; v1(31.18,73.6) 27.48,73.6 U1.48 ; v1(69.71,70.59) v1(71.19,69.11)
$1N9545: length 75.7
  Top Layer w0.74: U1.26 v1(64.86,77.3) ; v1(56.95,25.5) MotorDriver/Relay.8
  Bottom Layer w0.74: v1(64.86,77.3) 64.12,76.56 64.12,72.12 56.21,64.22 56.21,47.7 54.73,46.22 54.73,27.72 v1(56.95,25.5)
$1N9555: length 94.7
  Top Layer w0.74: MotorDriver/Relay.6 65.35,19.46 71.09,25.2 71.09,27.42 77.02,33.34 77.02,39.26 v1(81.46,43.7) ; v1(81.46,86.62) 74.8,93.28 U1.24 ; v1(84.42,79.96) v1(84.42,73.3)
  Bottom Layer w0.74: v1(84.42,73.3) 84.42,66.64 81.46,63.68 v1(81.46,43.7) ; v1(81.46,86.62) 81.46,82.92 v1(84.42,79.96)
$1N9567: length 92.9
  Top Layer w0.74: U1.19 74.68,87.36 77.64,87.36 79.86,85.14 v1(79.86,74.04) ; v1(77.64,28.16) 77.64,17.45 MotorDriver/Relay.3
  Bottom Layer w0.74: v1(77.64,28.16) 77.64,71.82 v1(79.86,74.04)
$1N9589: length 91.7
  Top Layer w0.74: U1.23 72.25,94.02 81.14,85.14 81.14,74.04 v1(80.4,73.3) ; v1(75.22,25.2) 75.22,22.8 MotorDriver/Relay.5
  Bottom Layer w0.74: v1(80.4,73.3) 78.92,71.82 78.92,28.16 75.96,25.2 v1(75.22,25.2)
$1N9599: length 75.7
  Top Layer w0.74: MotorDriver/Relay.7 61.15,21.48 v1(65.18,25.5) ; U1.25 69.62,79.52 v1(69.62,75.82)
  Bottom Layer w0.74: v1(65.18,25.5) 69.62,29.94 69.62,65.46 66.66,68.42 66.66,72.86 v1(69.62,75.82)
$1N9611: length 75
  Top Layer w0.74: v1(52.75,33.7) MotorDriver/Relay.9 ; U1.27 63.8,78.78 63.06,78.78 60.09,75.82 v1(60.09,74.34)
  Bottom Layer w0.74: v1(60.09,74.34) 60.09,69.9 52.75,62.56 v1(52.75,33.7)
$1N9625: length 81.6
  Top Layer w0.74: v1(62.42,79.52) 64.64,81.74 U1.29 ; v1(55.75,68.42) 55.02,68.42 52.06,65.46 52.06,63.98 45.4,57.32 44.66,57.32 42.44,55.1 42.44,53.62 45.4,50.66 45.4,44.74 44.35,43.7 MotorDriver/Relay.11 ; v1(61.68,71.38) v1(58.72,71.38)
  Bottom Layer w0.74: v1(58.72,71.38) v1(55.75,68.42) ; v1(62.42,79.52) 63.16,78.78 63.16,72.86 v1(61.68,71.38)
$1N9639: length 76.6
  Top Layer w0.74: v1(53.12,64.72) 53.12,61.76 v1(48.55,57.2) ; v1(48.55,25.38) MotorDriver/Relay.10 ; v1(63.47,83.22) 63.47,82.48 61.25,80.26 61.25,78.78 53.12,70.64 v1(53.12,68.42)
  Bottom Layer w0.74: v1(53.12,68.42) v1(53.12,64.72) ; v1(48.55,57.2) v1(48.55,25.38) ; U1.28 65.69,83.22 v1(63.47,83.22)
$1N9649: length 79.5
  Top Layer w0.74: MotorDriver/Relay.12 40.15,45 44.34,49.18 44.34,49.92 41.38,52.88 41.38,55.84 48.03,62.5 v1(48.78,62.5) ; v1(51.74,69.9) 51.74,71.38 59.88,79.52 59.88,82.48 U1.30
  Bottom Layer w0.74: v1(48.78,62.5) 48.78,66.94 v1(51.74,69.9)
$1N9665: length 100
  Top Layer w0.74: v1(56.28,70.64) 57.75,69.16 57.75,60.28 69.59,48.44 69.59,25.5 63.68,19.58 63.68,16.62 66.64,13.66 80.13,13.66 MotorDriver/Relay.14 ; v1(54.8,75.82) 57.02,78.04 U1.32
  Bottom Layer w0.74: v1(54.8,75.82) 55.53,75.82 57.97,73.38 57.97,72.34 v1(56.28,70.64)
$1N9673: length 92.5
  Top Layer w0.74: v1(69.28,21.06) 72.24,24.02 v1(72.24,26.98) ; v1(53.74,79.52) 54.47,80.26 54.47,84.7 ; v1(70.02,72.12) 67.8,74.34 v1(61.88,74.34)
  Bottom Layer w0.74: v1(69.28,21.06) 72.24,18.1 72.24,15.88 76.48,11.64 MotorDriver/Relay.15 ; v1(72.24,26.98) 72.97,27.72 72.97,69.16 v1(70.02,72.12) ; v1(61.88,74.34) 56.69,79.52 v1(53.74,79.52)
$1N9678: length 90.3
  Top Layer w0.74: v1(54.71,25.5) v1(54.71,21.06) ; v1(51.62,72.86) 51.62,82.48 U1.35
  Bottom Layer w0.74: v1(54.71,25.5) 51.75,28.46 51.75,68.55 53.09,69.9 53.09,71.38 v1(51.62,72.86) ; v1(54.71,21.06) 63.59,21.06 68.03,16.62 68.03,15.88 72.27,11.64 MotorDriver/Relay.16
$1N9686: length 89.1
  Top Layer w0.74: U1.36 50.56,81 v1(50.56,63.98) ; v1(50.56,36.6) 51.3,36.6 55.74,32.16 55.74,18.1 55,17.36 55,16.62 v1(55.74,15.88)
  Bottom Layer w0.74: MotorDriver/Relay.17 67.53,13.66 57.96,13.66 v1(55.74,15.88) ; v1(50.56,63.98) v1(50.56,36.6)
$1N12928: length 116.3
  Top Layer w0.74: v1(72.88,105.12) 74.36,106.6 76.23,106.6 85.85,96.98 85.85,73.3 83.63,71.08 v1(83.63,64.42) ; MotorDriver/Relay.2 82.15,19.28 79.93,21.5 v1(79.93,28.16)
  Bottom Layer w0.74: v1(83.63,64.42) 83.63,31.86 v1(79.93,28.16) ; v1(72.88,105.12) 64.74,105.12 U1.18
$1N13407: length 103.4
  Top Layer w0.74: v1(73.42,104.38) 74.9,104.38 83.03,96.24 83.03,86.62 82.3,85.88 v1(82.3,65.9) ; v1(80.08,33.34) 78.59,33.34 75.64,30.38 75.64,26.68 76.38,25.94 76.38,19.76 MotorDriver/Relay.4
  Bottom Layer w0.74: v1(73.42,104.38) 69.72,100.68 U1.22 ; v1(82.3,65.9) 80.08,63.68 v1(80.08,33.34)
$1N13585: length 92.1
  Top Layer w0.74: v1(58.08,79.52) 58.08,83.22 U1.31 ; v1(70.66,73.6) 69.92,73.6 67.69,75.82 v1(61.78,75.82) ; v1(76.58,29.94) 77.31,29.94 78.8,28.46 78.8,21.06 80.28,19.58 80.28,16.62 85.26,11.64 MotorDriver/Relay.13
  Bottom Layer w0.74: v1(58.08,79.52) v1(61.78,75.82) ; v1(76.58,29.94) 76.58,70.64 73.62,73.6 v1(70.66,73.6)
$1N13636: length 98.3
  Top Layer w0.74: U1.37 44.31,60.28 39.88,55.84 v1(39.88,52.14) ; v1(42.84,43.26) 42.84,16.39 44.31,14.91 50.97,14.91 v1(52.46,13.43)
  Bottom Layer w0.74: v1(52.46,13.43) 53.19,13.43 54.68,11.95 54.68,11.64 56.9,9.42 63.13,9.42 MotorDriver/Relay.18 ; v1(39.88,52.14) 39.88,49.18 41.36,47.7 42.09,47.7 42.84,46.96 v1(42.84,43.26)
$1N13655: length 90.5
  Top Layer w0.74: MotorDriver/Relay.19 59.61,10.09 56.03,10.09 55.3,10.83 55.3,12.31 50.86,16.75 50.86,24.76 v1(47.16,28.46)
  Bottom Layer w0.74: v1(47.16,28.46) 47.16,69.16 U1.42
$1N13664: length 91.2
  Top Layer w0.74: v1(46.09,51.4) 53.5,44 58.43,44 59.17,43.26 59.17,42.52 56.95,40.3 56.95,26.98 59.17,24.76 59.17,13.86 MotorDriver/Relay.20
  Bottom Layer w0.74: U1.43 46.09,67.68 v1(46.09,51.4)
$1N13701: length 89.4
  Top Layer w0.74: v1(36.16,61.02) 36.16,18.84 41.34,13.66 50.73,13.66 MotorDriver/Relay.21
  Bottom Layer w0.74: v1(36.16,61.02) 36.16,75.08 U1.44
$1N14167: length 504.2
  Top Layer w0.74: U1.47 21.88,81.74 37.42,81.74 v1(40.14,79.01) ; 87.43,55.65 v1(87.43,49.73) ; 87.43,55.65 88.91,54.17 94.83,54.17 95.57,54.91 95.57,57.13 98.53,60.09 112.2,60.09 116.39,64.28 v1(116.39,65.02) 116.39,72.74 470uf.2 117.94,77.63 v2(110.13,85.43) 110.13,100.01 CN5.2 ; 87.43,55.65 87.43,58.61 Switch.1 81.33,64.71 81.33,70.87 75.41,76.79 SMBJ5A.2 74.92,78.02 v1(74.92,79.01) ; v1(49.02,73.83) 46.06,76.79 v1(46.06,77.53) ; v1(55.68,71.61) 57.16,71.61 58.64,70.13 63.82,70.13 v1(65.3,71.61)
  Bottom Layer w0.74: v1(74.92,79.01) 73.44,77.53 69.74,77.53 65.3,73.09 v1(65.3,71.61) ; PLC#2.1 89.65,34.67 89.65,37.15 87.43,39.37 87.43,44.55 ; v1(55.68,71.61) 54.2,71.61 51.98,73.83 v1(49.02,73.83) ; U7.2 111.73,44.55 87.43,44.55 ; v1(46.06,77.53) 44.58,79.01 v1(40.14,79.01) ; 87.43,44.55 v1(87.43,49.73) ; MotorDriver/Relay.24 41.46,11.64 45.99,16.17 45.99,16.91 51.17,22.09 ; 78.09,23.11 77.07,22.09
  Bottom Layer w1: 470uf.2 123.31,74.29 123.56,74.03 ; v1(116.39,65.02) 123.69,65.02
  Bottom Layer w3: 101.81,59.87 86.18,59.87 Switch.1 ; 101.81,59.87 101.81,68.99 93.34,77.46 v2(75.33,77.46) ; 101.81,59.87 123.78,59.87 ; 116.42,44.6 116.2,44.82 113.53,44.82 ; 116.42,44.6 116.71,44.32 ; 116.42,44.6 117.62,44.6 ; 116.42,44.6 115.37,44.6 115.37,39.3 106.8,30.73 89.15,30.73 PLC#2.1 78.09,23.11 42.27,23.11 40.15,20.98 40.15,20.86 37.52,18.23 37.52,16.05 40.15,13.42 MotorDriver/Relay.24 ; 117.62,44.6 123.78,50.75 123.78,59.87 ; 117.62,44.6 117.48,44.46 ; 123.78,59.87 123.78,79.79 121.66,81.91 113.66,81.91 v2(110.13,85.43) 110.44,85.74 CN5.2 ; 113.38,44.6 113.35,44.57 112.01,44.57
$1N14276: length 11.2
  Top Layer w3: Switch.2 87.04,62.96 88.02,62.96 93.12,57.85 SWITCH.2
$1N15124: length 137
  Top Layer w0.74: U1.56 68.17,86.25 75.57,86.25 76.31,85.51 76.31,84.03 71.87,79.59 71.87,71.45 69.65,69.23 69.65,61.09 67.43,58.87 v1(67.43,52.21) ; v1(58.55,49.99) 53.37,55.17 44.49,55.17 v1(43.75,54.43)
  Bottom Layer w0.74: 67.43,49.99 v1(58.55,49.99) ; 67.43,49.99 JP9.5 ; 67.43,49.99 v1(67.43,52.21) ; U1.56 70.97,92.32 76.82,98.17 76.82,116.29 Rm3100/Smartelex.3 ; Bar30.2 38.68,54.43 v1(43.75,54.43)
$1N15145: length 165.6
  Top Layer w0.74: v1(58.01,42.77) 46.91,42.77 v1(46.17,42.03) ; v1(74.34,102.26) 76.56,100.04 76.56,99.3 v1(75.82,98.56) ; v1(83.22,72.43) 83.22,85.24 83.96,85.98 83.96,97.08 v1(75.82,105.22) ; v1(70.64,59.85) v1(68.42,57.63)
  Bottom Layer w0.74: 74.34,105.22 v1(75.82,105.22) ; 74.34,105.22 72.12,107.44 72.12,117.03 Rm3100/Smartelex.4 ; 74.34,105.22 v1(74.34,102.26) ; Bar30.1 31.8,47.95 35.07,47.95 35.81,47.21 35.81,45.73 39.51,42.03 v1(46.17,42.03) ; v1(75.82,98.56) 72.12,94.86 U1.55 ; v1(70.64,59.85) 70.64,65.77 68.42,67.99 68.42,73.17 70.64,75.39 80.26,75.39 v1(83.22,72.43) ; v1(58.01,42.77) 57.27,43.51 JP9.1 57.32,46.53 57.32,50.23 64.72,57.63 v1(68.42,57.63)
$1N15159: length 81.5
  Bottom Layer w0.74: Rm3100/Smartelex.1 80.03,117.5 80.03,87.9 74.12,81.98 36.88,81.98 U1.41
$1N15450: length 37.5
  Top Layer w0.74: Bar30.3 37.94,74.34 41.64,78.04 41.64,82.29 U1.39
$1N16739: length 38.6
  Bottom Layer w0.74: U1.1 33.85,117.42 Thrusters.8
$1N19793: length 23.5
  Top Layer w0.74: Thrusters.7 49.28,115.94 49.28,112.95 v1(50.76,111.47)
  Bottom Layer w0.74: U1.10 v1(50.76,111.47)
$1N19945: length 44.5
  Bottom Layer w0.74: Thrusters.1 55.08,116.11 55.08,118.12 54.34,118.86 49.9,118.86 49.16,118.12 49.16,116.64 48.42,115.9 39.95,115.9 U1.4
$1N19970: length 38.1
  Top Layer w0.74: Thrusters.2 52.11,116.07 52.11,118.12 51.37,118.86 45.45,118.86 U1.5
$1N23846: length 84.8
  Top Layer w0.74: U1.2 18.92,91.81 13,85.89 13,82.5 22.62,72.88 22.62,68.13 v1(35.2,55.55) ; v1(44.81,54.07) 52.22,54.07 JP9.2
  Bottom Layer w0.74: v1(44.81,54.07) 44.81,54.81 44.08,55.55 v1(35.2,55.55)
$1N23850: length 87.3
  Top Layer w0.74: JP9.3 62.16,46.67 62.16,48.88 54.75,56.28 v1(45.14,56.28) ; U1.3 19.98,98.46 v1(19.98,94.76)
  Bottom Layer w0.74: v1(19.98,94.76) 19.24,94.76 12.58,88.1 12.58,82.92 38.48,57.02 44.4,57.02 v1(45.14,56.28)
$1N23939: length 101.8
  Top Layer w0.74: v1(74.51,56.11) 73.77,56.11 v1(68.59,50.93) ; v1(76.73,86.45) 77.47,85.71 77.47,83.49 73.03,79.05 v1(73.03,72.39) ; v1(68.59,47.97) 66.38,47.97 JP9.4 ; v1(75.99,93.85) 77.47,95.33 77.47,100.51 74.51,103.47 45.3,103.47 U1.11
  Bottom Layer w0.74: v1(68.59,50.93) v1(68.59,47.97) ; v1(76.73,86.45) 75.99,87.19 v1(75.99,93.85) ; v1(73.03,72.39) 74.51,70.91 v1(74.51,56.11)
$1N25899: length 6.3
  Top Layer w3: PLC.2 91.02,40 PLC#2.2
$1N25912: length 125.7
  Top Layer w0.74: SWITCH.1 108.79,56.25 ; 108.79,56.25 113.97,51.07 113.97,44.25 U7.1 99.27,42.03 PLC.1 ; 108.79,56.25 U5.1
  Top Layer w3: 115.66,41.65 115.66,36.16 113.91,34.41 102.82,34.41 PLC.1 ; 115.66,41.65 116.71,41.65 120.39,45.33 120.39,51.68 118.1,53.97 113.57,53.97 110.23,57.31 ; 115.66,41.65 112.13,41.65 ; 120.01,49.4 116.83,49.4 115.44,50.79 103.71,50.79 98,56.51
$1N26259: length 14
  Top Layer w0.74: 47nf.2 42.37,92.45 34.79,92.45 U1.52

## Text on the board
Bottom Layer: DRDY | 3.3v | GND | SDA | SCL
Bottom Silkscreen Layer: TX+ | TX- | RX- | RX+ | - | + | B | A | G | RTS | 5 | 3 | 2 | 1 | 3-5V | RX-I | TX-O | GND | RS485
Top Silkscreen Layer: GND | R3 | R2 | R1 | S8 | S7 | S6 | S5 | S4 | S3 | S2 | S1 | 5V | 4R4 | 4R3 | 4R2 | 4R1 | R8 | R7 | R6 | R5 | R4 | 4 | 7 | 3 | 6 | 5 | 2 | 1 | VOUT | + | VIN | -
